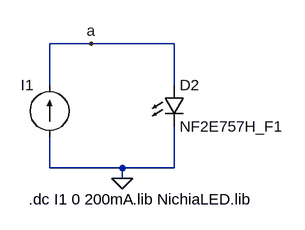
[diagram p0: schematic LED-VI-1-F.asc]
LED-VI-1-F.asc, the LTspice schematic file:
Version 4
SHEET 1 880 680
WIRE 0 160 -64 160
WIRE 128 160 0 160
WIRE -64 224 -64 160
WIRE 128 224 128 160
WIRE -64 352 -64 304
WIRE 48 352 -64 352
WIRE 128 352 128 288
WIRE 128 352 48 352
WIRE 48 368 48 352
FLAG 48 368 0
FLAG 0 160 a
SYMBOL current -64 304 R180
WINDOW 0 24 80 Left 2
WINDOW 3 24 0 Invisible 2
WINDOW 123 0 0 Left 2
WINDOW 39 0 0 Left 2
SYMATTR InstName I1
SYMATTR Value 0
SYMBOL LED 112 224 R0
SYMATTR InstName D2
SYMATTR Value NF2E757H_F1
TEXT -96 400 Left 2 !.dc I1 0 200mA
TEXT 64 400 Left 2 !.lib NichiaLED.lib

The netlist it stands for:
* LED-VI-1-F.asc
I1 0 a 0
D2 a 0 NF2E757H_F1
.model D D
.lib standard.dio
.dc I1 0 200mA
.lib NichiaLED.lib
.backanno
.end